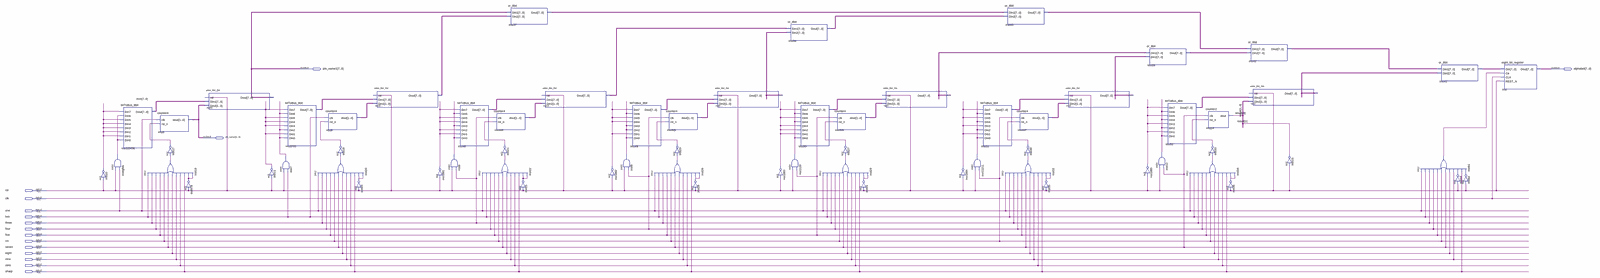
[diagram p0: schematic sheet, whole]
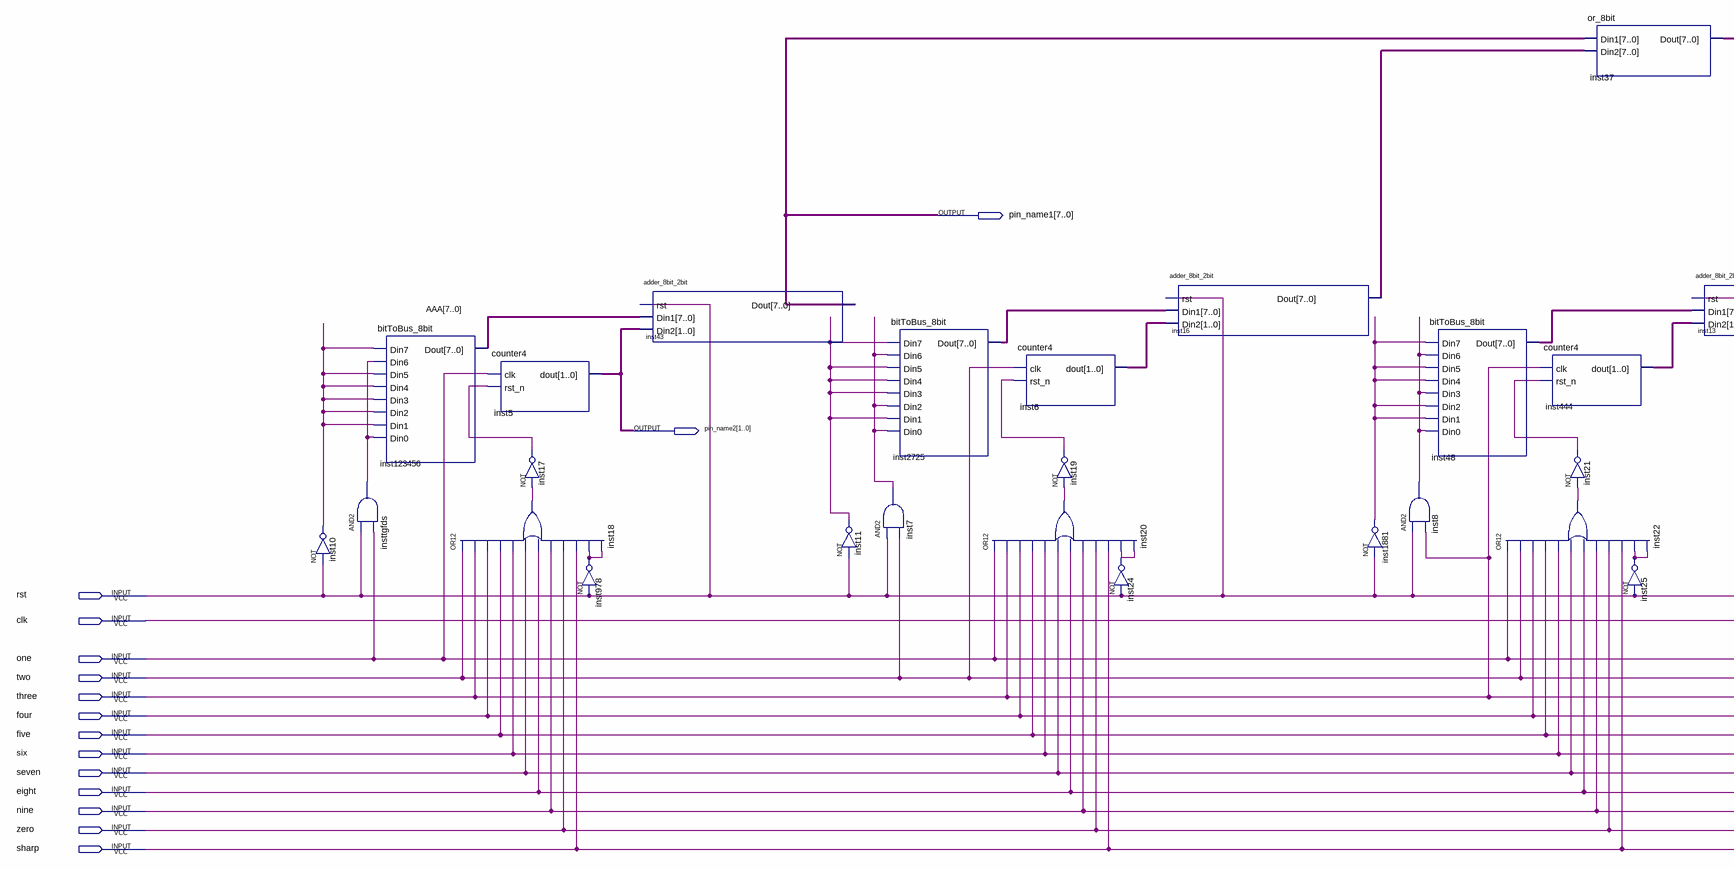
[diagram p1: schematic sheet, left part]
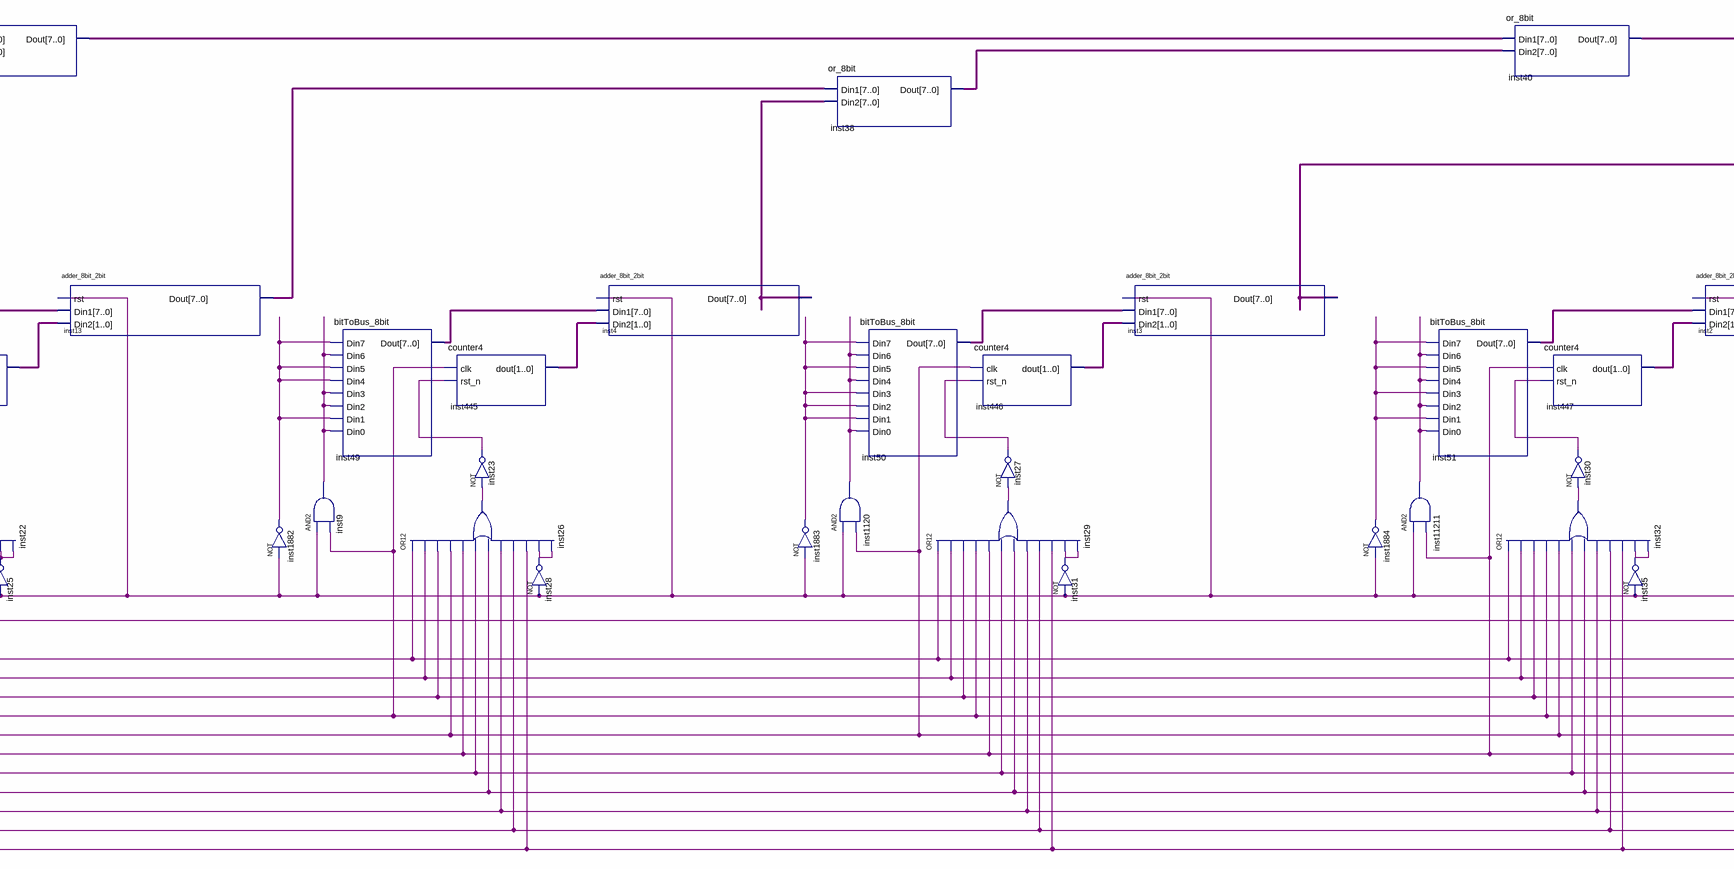
[diagram p2: schematic sheet, centre part]
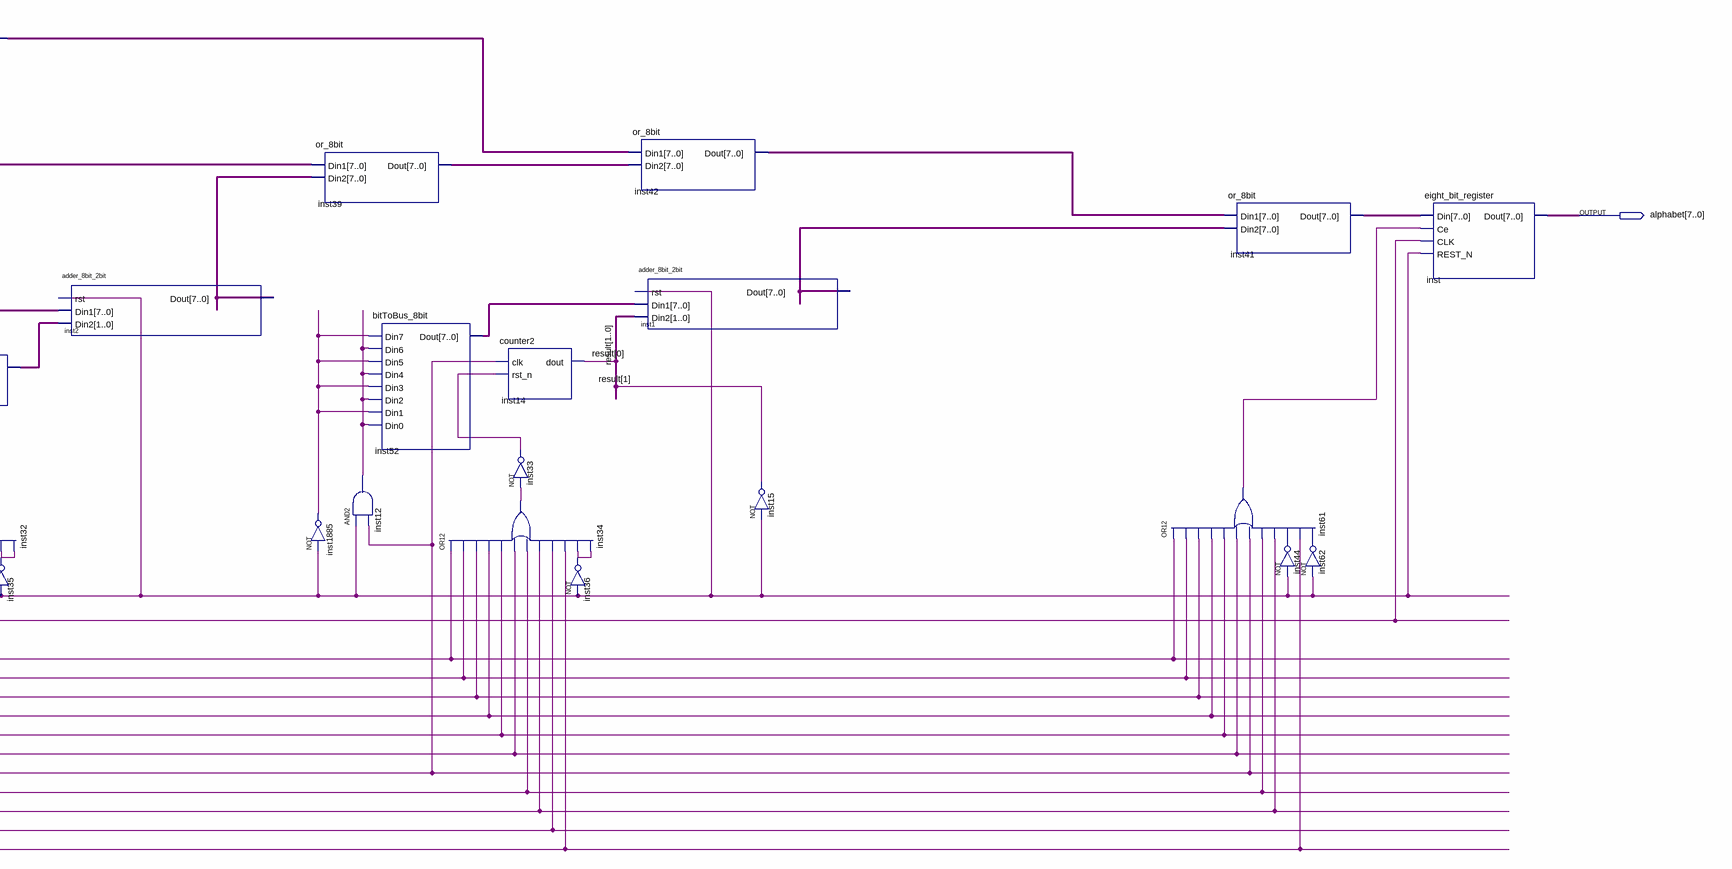
[diagram p3: schematic sheet, right part]
// Quartus schematic decimal_to_alphabet.bdf as structural Verilog: 67 symbols, 16 pins
module decimal_to_alphabet (
  input  rst,
  input  clk,
  input  one,
  input  two,
  input  three,
  input  four,
  input  five,
  input  six,
  input  seven,
  input  eight,
  input  nine,
  input  zero,
  input  sharp,
  output [7:0] pin_name1,
  output [7:0] alphabet,
  output [1:0] pin_name2
);

  wire inst7_out, inst8_out, inst9_out, inst10_out, inst11_out, inst12_out, inst17_out, inst18_out,
       inst19_out, inst20_out, inst21_out, inst22_out, inst23_out, inst24_out, inst25_out, inst26_out,
       inst27_out, inst28_out, inst29_out, inst30_out, inst31_out, inst32_out, inst33_out, inst34_out,
       inst35_out, inst36_out, inst44_out, inst61_out, inst62_out, inst978_out, inst1120_out, inst1881_out,
       inst1882_out, inst1883_out, inst1884_out, inst1885_out, inst11211_out, insttgfds_out;
  wire [1:0] inst6_dout, inst444_dout, inst445_dout, inst446_dout, inst447_dout, result;
  wire [7:0] AAA, inst1_dout, inst2_dout, inst3_dout, inst4_dout, inst13_dout, inst16_dout, inst37_dout,
       inst38_dout, inst39_dout, inst40_dout, inst41_dout, inst42_dout, inst48_dout, inst49_dout,
       inst50_dout, inst51_dout, inst52_dout, inst2725_dout;

  not inst10 (inst10_out, rst);
  bitToBus_8bit inst123456 (
    .Din7(inst10_out), .Din6(insttgfds_out), .Din5(inst10_out), .Din4(inst10_out), .Din3(inst10_out),
    .Din2(inst10_out), .Din1(inst10_out), .Din0(insttgfds_out), .Dout(AAA));
  and insttgfds (insttgfds_out, rst, one);
  or inst18 (inst18_out, two, three, four, five, six, seven, eight, nine, zero, sharp, inst978_out, inst978_out);
  counter4 inst5 (.clk(one), .rst_n(inst17_out), .dout(pin_name2));
  not inst17 (inst17_out, inst18_out);
  not inst978 (inst978_out, rst);
  adder_8bit_2bit inst43 (.rst(rst), .Din1(AAA), .Din2(pin_name2), .Dout(pin_name1));
  and inst7 (inst7_out, rst, two);
  not inst11 (inst11_out, rst);
  bitToBus_8bit inst2725 (
    .Din7(inst11_out), .Din6(inst7_out), .Din5(inst11_out), .Din4(inst11_out), .Din3(inst11_out),
    .Din2(inst7_out), .Din1(inst11_out), .Din0(inst7_out), .Dout(inst2725_dout));
  or inst20 (inst20_out, one, three, four, five, six, seven, eight, nine, zero, sharp, inst24_out, inst24_out);
  counter4 inst6 (.clk(two), .rst_n(inst19_out), .dout(inst6_dout));
  not inst19 (inst19_out, inst20_out);
  not inst24 (inst24_out, rst);
  adder_8bit_2bit inst16 (.rst(rst), .Din1(inst2725_dout), .Din2(inst6_dout), .Dout(inst16_dout));
  not inst1881 (inst1881_out, rst);
  bitToBus_8bit inst48 (
    .Din7(inst1881_out), .Din6(inst8_out), .Din5(inst1881_out), .Din4(inst1881_out), .Din3(inst8_out),
    .Din2(inst1881_out), .Din1(inst1881_out), .Din0(inst8_out), .Dout(inst48_dout));
  and inst8 (inst8_out, rst, three);
  counter4 inst444 (.clk(three), .rst_n(inst21_out), .dout(inst444_dout));
  or inst22 (inst22_out, one, two, four, five, six, seven, eight, nine, zero, sharp, inst25_out, inst25_out);
  or_8bit inst37 (.Din1(pin_name1), .Din2(inst16_dout), .Dout(inst37_dout));
  not inst21 (inst21_out, inst22_out);
  not inst25 (inst25_out, rst);
  adder_8bit_2bit inst13 (.rst(rst), .Din1(inst48_dout), .Din2(inst444_dout), .Dout(inst13_dout));
  and inst9 (inst9_out, rst, four);
  not inst1882 (inst1882_out, rst);
  bitToBus_8bit inst49 (
    .Din7(inst1882_out), .Din6(inst9_out), .Din5(inst1882_out), .Din4(inst1882_out), .Din3(inst9_out),
    .Din2(inst9_out), .Din1(inst1882_out), .Din0(inst9_out), .Dout(inst49_dout));
  or inst26 (inst26_out, one, two, three, five, six, seven, eight, nine, zero, sharp, inst28_out, inst28_out);
  counter4 inst445 (.clk(four), .rst_n(inst23_out), .dout(inst445_dout));
  not inst23 (inst23_out, inst26_out);
  not inst28 (inst28_out, rst);
  adder_8bit_2bit inst4 (.rst(rst), .Din1(inst49_dout), .Din2(inst445_dout), .Dout(inst4_dout));
  not inst1883 (inst1883_out, rst);
  or_8bit inst38 (.Din1(inst13_dout), .Din2(inst4_dout), .Dout(inst38_dout));
  bitToBus_8bit inst50 (
    .Din7(inst1883_out), .Din6(inst1120_out), .Din5(inst1883_out), .Din4(inst1120_out), .Din3(inst1883_out),
    .Din2(inst1883_out), .Din1(inst1883_out), .Din0(inst1120_out), .Dout(inst50_dout));
  and inst1120 (inst1120_out, rst, five);
  counter4 inst446 (.clk(five), .rst_n(inst27_out), .dout(inst446_dout));
  or inst29 (inst29_out, one, two, three, four, six, seven, eight, nine, zero, sharp, inst31_out, inst31_out);
  not inst27 (inst27_out, inst29_out);
  not inst31 (inst31_out, rst);
  adder_8bit_2bit inst3 (.rst(rst), .Din1(inst50_dout), .Din2(inst446_dout), .Dout(inst3_dout));
  not inst1884 (inst1884_out, rst);
  bitToBus_8bit inst51 (
    .Din7(inst1884_out), .Din6(inst11211_out), .Din5(inst1884_out), .Din4(inst11211_out),
    .Din3(inst1884_out), .Din2(inst11211_out), .Din1(inst1884_out), .Din0(inst11211_out), .Dout(inst51_dout));
  and inst11211 (inst11211_out, rst, six);
  or_8bit inst40 (.Din1(inst37_dout), .Din2(inst38_dout), .Dout(inst40_dout));
  or inst32 (inst32_out, one, two, three, four, five, seven, eight, nine, zero, sharp, inst35_out, inst35_out);
  counter4 inst447 (.clk(six), .rst_n(inst30_out), .dout(inst447_dout));
  not inst30 (inst30_out, inst32_out);
  not inst35 (inst35_out, rst);
  adder_8bit_2bit inst2 (.rst(rst), .Din1(inst51_dout), .Din2(inst447_dout), .Dout(inst2_dout));
  or_8bit inst39 (.Din1(inst3_dout), .Din2(inst2_dout), .Dout(inst39_dout));
  and inst12 (inst12_out, rst, seven);
  not inst1885 (inst1885_out, rst);
  bitToBus_8bit inst52 (
    .Din7(inst1885_out), .Din6(inst12_out), .Din5(inst1885_out), .Din4(inst12_out), .Din3(inst1885_out),
    .Din2(inst12_out), .Din1(inst1885_out), .Din0(inst12_out), .Dout(inst52_dout));
  or inst34 (inst34_out, one, two, three, four, five, six, eight, nine, zero, sharp, inst36_out, inst36_out);
  counter2 inst14 (.clk(seven), .rst_n(inst33_out), .dout(result[0]));
  not inst33 (inst33_out, inst34_out);
  not inst36 (inst36_out, rst);
  or_8bit inst42 (.Din1(inst40_dout), .Din2(inst39_dout), .Dout(inst42_dout));
  adder_8bit_2bit inst1 (.rst(rst), .Din1(inst52_dout), .Din2(result), .Dout(inst1_dout));
  not inst15 (result[1], rst);
  or inst61 (inst61_out, one, two, three, four, five, six, seven, eight, nine, inst44_out, sharp, inst62_out);
  or_8bit inst41 (.Din1(inst42_dout), .Din2(inst1_dout), .Dout(inst41_dout));
  not inst62 (inst62_out, rst);
  not inst44 (inst44_out, rst);
  eight_bit_register inst (.Din(inst41_dout), .Ce(inst61_out), .CLK(clk), .REST_N(rst), .Dout(alphabet));
endmodule
